# Altium schematic sheet ATU_LC.SchDoc: Приемопередатчик  SDR200
size 420 x 297 mm; Author: В.Титов; DrawnBy: В.Титов; DocumentNumber: ХХХХ.468179.001 Э3; SheetNumber: 3; SheetTotal: 3; DocumentType: Схема электрическая принципиальная; Title2: Согласующее устройство; Scale: 1:1
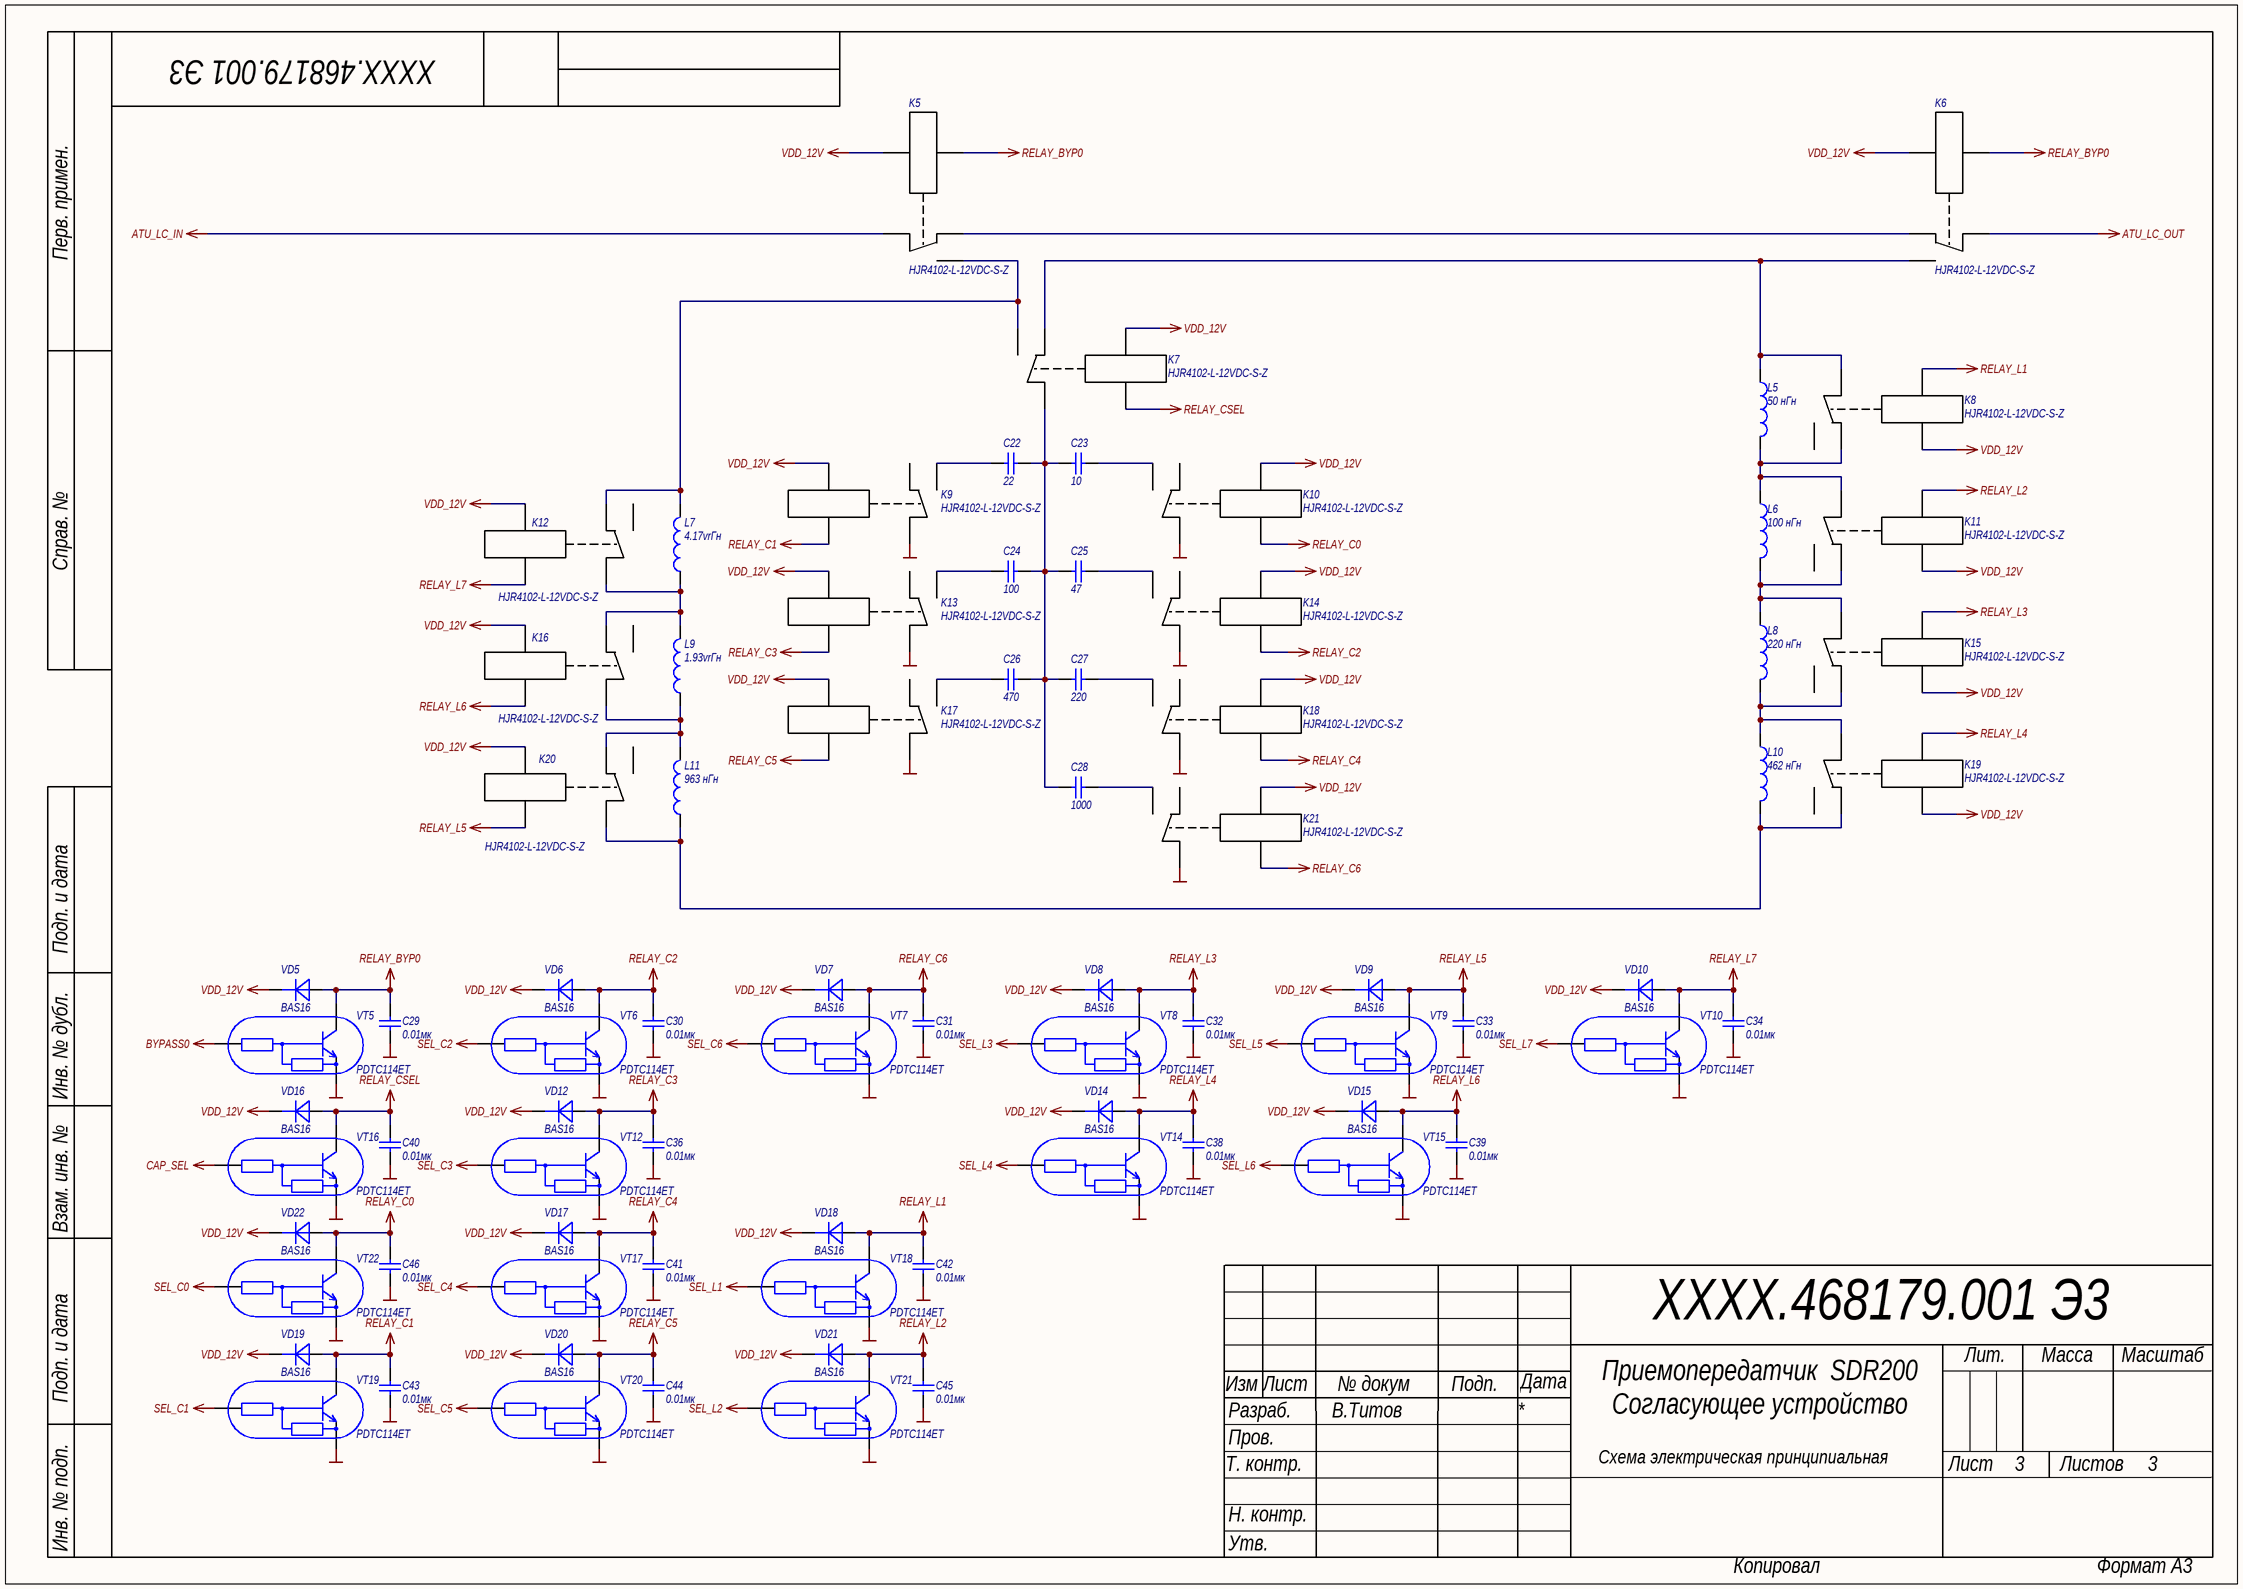
[diagram p0: ATU_LC.SchDoc]

## Parts
C22  22  [CAPC3216X19L]
C23  10  [CAPC3216X19L]
C24  100  [CAPC3216X19L]
C25  47  [CAPC3216X19L]
C26  470  [CAPC3216X19L]
C27  220  [CAPC3216X19L]
C28  1000  [CAPC3216X19L]
C29  0.01мк  [CAPC1005X06N]
C30  0.01мк  [CAPC1005X06N]
C31  0.01мк  [CAPC1005X06N]
C32  0.01мк  [CAPC1005X06N]
C33  0.01мк  [CAPC1005X06N]
C34  0.01мк  [CAPC1005X06N]
C36  0.01мк  [CAPC1005X06N]
C38  0.01мк  [CAPC1005X06N]
C39  0.01мк  [CAPC1005X06N]
C40  0.01мк  [CAPC1005X06N]
C41  0.01мк  [CAPC1005X06N]
C42  0.01мк  [CAPC1005X06N]
C43  0.01мк  [CAPC1005X06N]
C44  0.01мк  [CAPC1005X06N]
C45  0.01мк  [CAPC1005X06N]
C46  0.01мк  [CAPC1005X06N]
K5  HJR4102-L-12VDC-S-Z  [HJR4102]
K6  HJR4102-L-12VDC-S-Z  [HJR4102]
K7  HJR4102-L-12VDC-S-Z  [HJR4102]
K8  HJR4102-L-12VDC-S-Z  [HJR4102]
K9  HJR4102-L-12VDC-S-Z  [HJR4102]
K10  HJR4102-L-12VDC-S-Z  [HJR4102]
K11  HJR4102-L-12VDC-S-Z  [HJR4102]
K12  HJR4102-L-12VDC-S-Z  [HJR4102]
K13  HJR4102-L-12VDC-S-Z  [HJR4102]
K14  HJR4102-L-12VDC-S-Z  [HJR4102]
K15  HJR4102-L-12VDC-S-Z  [HJR4102]
K16  HJR4102-L-12VDC-S-Z  [HJR4102]
K17  HJR4102-L-12VDC-S-Z  [HJR4102]
K18  HJR4102-L-12VDC-S-Z  [HJR4102]
K19  HJR4102-L-12VDC-S-Z  [HJR4102]
K20  HJR4102-L-12VDC-S-Z  [HJR4102]
K21  HJR4102-L-12VDC-S-Z  [HJR4102]
L5  50 нГн  [COIL D4 W3 L3]
L6  100 нГн  [COIL D6.4 W4 L3.5]
L7  4.17vrГн  [T68-2x2]
L8  220 нГн  [COIL D6.4 W7 L6]
L9  1.93vrГн  [T68-2x2]
L10  462 нГн  [T68-2]
L11  963 нГн  [T68-2]
VD5  BAS16  [SOT23_N]
VD6  BAS16  [SOT23_N]
VD7  BAS16  [SOT23_N]
VD8  BAS16  [SOT23_N]
VD9  BAS16  [SOT23_N]
VD10  BAS16  [SOT23_N]
VD12  BAS16  [SOT23_N]
VD14  BAS16  [SOT23_N]
VD15  BAS16  [SOT23_N]
VD16  BAS16  [SOT23_N]
VD17  BAS16  [SOT23_N]
VD18  BAS16  [SOT23_N]
VD19  BAS16  [SOT23_N]
VD20  BAS16  [SOT23_N]
VD21  BAS16  [SOT23_N]
VD22  BAS16  [SOT23_N]
VT5  PDTC114ET  [SOT23_N]
VT6  PDTC114ET  [SOT23_N]
VT7  PDTC114ET  [SOT23_N]
VT8  PDTC114ET  [SOT23_N]
VT9  PDTC114ET  [SOT23_N]
VT10  PDTC114ET  [SOT23_N]
VT12  PDTC114ET  [SOT23_N]
VT14  PDTC114ET  [SOT23_N]
VT15  PDTC114ET  [SOT23_N]
VT16  PDTC114ET  [SOT23_N]
VT17  PDTC114ET  [SOT23_N]
VT18  PDTC114ET  [SOT23_N]
VT19  PDTC114ET  [SOT23_N]
VT20  PDTC114ET  [SOT23_N]
VT21  PDTC114ET  [SOT23_N]
VT22  PDTC114ET  [SOT23_N]

## Nets
ATU_LC_IN: K5.1
ATU_LC_OUT: K6.1
BYPASS0: VT5.1(B)
CAP_SEL: VT16.1(B)
GND: C29.1 C30.1 C31.1 C32.1 C33.1 C34.1 C36.1 C38.1 C39.1 C40.1 C41.1 C42.1 C43.1 C44.1 C45.1 C46.1 K9.1 K10.1 K13.1 K14.1 K17.1 K18.1 K21.1 VT5.2(E) VT6.2(E) VT7.2(E) VT8.2(E) VT9.2(E) VT10.2(E) VT12.2(E) VT14.2(E) VT15.2(E) VT16.2(E) VT17.2(E) VT18.2(E) VT19.2(E) VT20.2(E) VT21.2(E) VT22.2(E)
RELAY_BYP0: C29.2 K5.5 K6.8 VD5.1(A) VT5.3(C)
RELAY_C0: C46.2 K10.8 VD22.1(A) VT22.3(C)
RELAY_C1: C43.2 K9.8 VD19.1(A) VT19.3(C)
RELAY_C2: C30.2 K14.8 VD6.1(A) VT6.3(C)
RELAY_C3: C36.2 K13.8 VD12.1(A) VT12.3(C)
RELAY_C4: C41.2 K18.8 VD17.1(A) VT17.3(C)
RELAY_C5: C44.2 K17.8 VD20.1(A) VT20.3(C)
RELAY_C6: C31.2 K21.8 VD7.1(A) VT7.3(C)
RELAY_CSEL: C40.2 K7.8 VD16.1(A) VT16.3(C)
RELAY_L1: C42.2 K8.8 VD18.1(A) VT18.3(C)
RELAY_L2: C45.2 K11.8 VD21.1(A) VT21.3(C)
RELAY_L3: C32.2 K15.8 VD8.1(A) VT8.3(C)
RELAY_L4: C38.2 K19.8 VD14.1(A) VT14.3(C)
RELAY_L5: C33.2 K20.8 VD9.1(A) VT9.3(C)
RELAY_L6: C39.2 K16.8 VD15.1(A) VT15.3(C)
RELAY_L7: C34.2 K12.8 VD10.1(A) VT10.3(C)
SEL_C0: VT22.1(B)
SEL_C1: VT19.1(B)
SEL_C2: VT6.1(B)
SEL_C3: VT12.1(B)
SEL_C4: VT17.1(B)
SEL_C5: VT20.1(B)
SEL_C6: VT7.1(B)
SEL_L1: VT18.1(B)
SEL_L2: VT21.1(B)
SEL_L3: VT8.1(B)
SEL_L4: VT14.1(B)
SEL_L5: VT9.1(B)
SEL_L6: VT15.1(B)
SEL_L7: VT10.1(B)
VDD_12V: K5.8 K6.5 K7.5 K8.5 K9.5 K10.5 K11.5 K12.5 K13.5 K14.5 K15.5 K16.5 K17.5 K18.5 K19.5 K20.5 K21.5 VD5.3(K) VD6.3(K) VD7.3(K) VD8.3(K) VD9.3(K) VD10.3(K) VD12.3(K) VD14.3(K) VD15.3(K) VD16.3(K) VD17.3(K) VD18.3(K) VD19.3(K) VD20.3(K) VD21.3(K) VD22.3(K)
NetC22_1: C22.1 C23.2 C24.1 C25.2 C26.1 C27.2 C28.2 K7.1
NetC22_2: C22.2 K9.6
NetC23_1: C23.1 K10.6
NetC24_2: C24.2 K13.6
NetC25_1: C25.1 K14.6
NetC26_2: C26.2 K17.6
NetC27_1: C27.1 K18.6
NetC28_1: C28.1 K21.6
NetK5_6: K5.6 K7.6 K12.7 L7.2
NetK5_7: K5.7 K6.7
NetK6_6: K6.6 K7.7 K8.1 L5.1
NetK8_7: K8.7 K11.1 L5.2 L6.1
NetK11_7: K11.7 K15.1 L6.2 L8.1
NetK12_1: K12.1 K16.7 L7.1 L9.2
NetK15_7: K15.7 K19.1 L8.2 L10.1
NetK16_1: K16.1 K20.7 L9.1 L11.2
NetK19_7: K19.7 K20.1 L10.2 L11.1

Not connected (* = marked no-connect by the designer): K8 6; K9 7; K10 7; K11 6; K12 6; K13 7; K14 7; K15 6; K16 6; K17 7; K18 7; K19 6; K20 6; K21 7

## Notes on the sheet
- Перв. примен.
- Справ. №
- Подп. и дата
- Инв. № дубл.
- Взам. инв. №
- Изм
- Лист
- № докум
- Подп.
- Дата
- Лит.
- Масса
- Масштаб
- Т. контр.
- Разраб.
- Пров.
- Листов
- Н. контр.
- Инв. № подп.
- Утв.
- Копировал
- Формат А3

## Library data of the parts
C22 = Кер.ЧИП конд. 1206 22пФ NP0 5% 2000В: Кер. ЧИП-конденсатор; Manufacturer: WALSIN; ManufacturerPartNumber: 1206N220J202; Power/Voltage: 2000В; TKE: NP0; Tolerance: ±5%; Value: 22
C23 = Кер.ЧИП конд. 1206 10пФ NP0 5% 2000В: Кер. ЧИП-конденсатор; Manufacturer: WALSIN; ManufacturerPartNumber: 1206N100J202; Power/Voltage: 2000В; TKE: NP0; Tolerance: ±5%; Value: 10
C24 = Кер.ЧИП конд. 1206 100пФ NP0 5% 2000В: Кер. ЧИП-конденсатор; Manufacturer: WALSIN; ManufacturerPartNumber: 1206N101J202; Power/Voltage: 2000В; TKE: NP0; Tolerance: ±5%; Value: 100
C25 = Кер.ЧИП конд. 1206 47пФ NP0 5% 2000В: Кер. ЧИП-конденсатор; Manufacturer: WALSIN; ManufacturerPartNumber: 1206N470J202; Power/Voltage: 2000В; TKE: NP0; Tolerance: ±5%; Value: 47
C26 = Кер.ЧИП конд. 1206 470пФ NP0 10% 2000В: Кер. ЧИП-конденсатор; Manufacturer: WALSIN; ManufacturerPartNumber: 1206B471K202; Power/Voltage: 2000В; TKE: NP0; Tolerance: ±10%; Value: 470
C27 = Кер.ЧИП конд. 1206 220пФ NP0 5% 2000В: Кер. ЧИП-конденсатор; Manufacturer: Johanson; ManufacturerPartNumber: 202R18W102KV4E; Power/Voltage: 2000В; TKE: X7R; Tolerance: ±10%; Value: 220
C28 = Кер.ЧИП конд. 1206 1000пФ X7К 10% 2000В: Кер. ЧИП-конденсатор; Manufacturer: Johanson; ManufacturerPartNumber: 202R18W102KV4E; Power/Voltage: 2000В; TKE: X7R; Tolerance: ±10%; Value: 1000
C29-C34 C36 C38-C46 = Кер.ЧИП конд. 0402 0.01мкФ X7R 10%, 50В: Кер. ЧИП-конденсатор; Power/Voltage: 50В; TKE: X7R; Tolerance: ±20%; Value: 0.01мк
K5-K21 = Реле HJR4102-L-12VDC-S-Z: Реле 1пер. 12VDC, 1A/240VAC; Value: HJR4102-L-12VDC-S-Z; ComponentLink1Description: datasheet; ComponentLink1URL: https://www.ti.com/lit/ds/symlink/tlvh431a.pdf?ts=1606914625003&ref_url=https%253A%252F%252Fwww.google.com%252F
L5 = Индуктивность 50 нГн: 3 витка, диаметр 4мм, длина 3мм, провод 0,5мм; Value: 50 нГн
L6 = Индуктивность  100 нГн: 4 витка, диаметр 6мм, длина 3.5мм, провод 0.8мм; Value: 100 нГн
L7 = Индуктивность 2XT68-2 4.17vrГн: 13 витков на 2 кольцах; Value: 4.17vrГн
L8 = Индуктивность 220 нГн: 7 витков, диаметр 6мм, длина 6мм, провод 0.8мм; Value: 220 нГн
L9 = Индуктивность 2XT68-2 1.93vrГн: 13 витков на 2 кольцах; Value: 1.93vrГн
L10 = Индуктивность T68-2 462 нГн: 9 витков; Value: 462 нГн
L11 = Индуктивность T68-2 963 нГн: 13 витков; Value: 963 нГн
VD5-VD10 VD12 VD14-VD22 = ЧИП диод BAS16: High-speed switching diodes; Manufacturer: Nexperia; Power/Voltage: 100В; ManufacturerPartNumber: BAS16; Value: BAS16; ComponentLink1Description: datasheet; ComponentLink1URL: https://assets.nexperia.com/documents/data-sheet/BAS16_SER.pdf
VT5-VT10 VT12 VT14-VT22 = ЧИП транзистор PDTC114ET: NPN resistor-equipped transistors;  R1 = 10 k, R2 = 10; ComponentLink1Description: datasheet; ComponentLink1URL: https://assets.nexperia.com/documents/data-sheet/PDTC114E_SER.pdf; Value: PDTC114ET